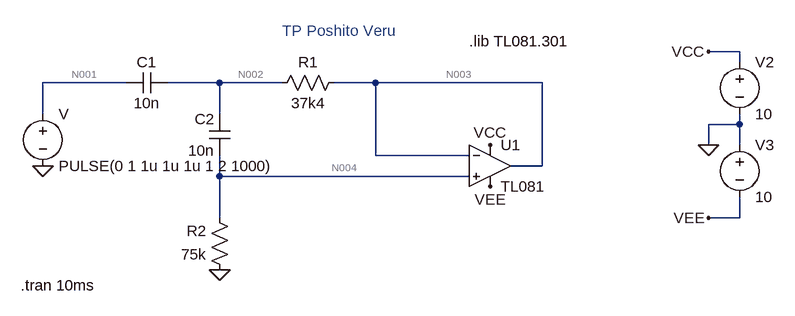
[diagram p0: schematic CIRCUITO_TP_respuesta_escalon.asc]
CIRCUITO_TP_respuesta_escalon.asc, the LTspice schematic file:
Version 4
SHEET 1 1032 680
WIRE 944 -64 896 -64
WIRE 944 -48 944 -64
WIRE 0 -16 -128 -16
WIRE 144 -16 64 -16
WIRE 240 -16 144 -16
WIRE 384 -16 320 -16
WIRE 640 -16 384 -16
WIRE -128 32 -128 -16
WIRE 144 32 144 -16
WIRE 944 48 944 32
WIRE 944 48 896 48
WIRE 896 80 896 48
WIRE 944 80 944 48
WIRE 384 96 384 -16
WIRE 528 96 384 96
WIRE 640 112 640 -16
WIRE 640 112 592 112
WIRE 144 128 144 96
WIRE 528 128 144 128
WIRE 144 192 144 128
WIRE 944 192 944 160
WIRE 944 192 896 192
FLAG -128 112 0
FLAG 144 272 0
FLAG 560 144 VEE
FLAG 560 80 VCC
FLAG 896 80 0
FLAG 896 192 VEE
FLAG 896 -64 VCC
SYMBOL cap 64 -32 R90
WINDOW 0 0 32 VBottom 2
WINDOW 3 32 32 VTop 2
SYMATTR InstName C1
SYMATTR Value 10n
SYMBOL cap 160 96 R180
WINDOW 0 24 56 Left 2
WINDOW 3 24 8 Left 2
SYMATTR InstName C2
SYMATTR Value 10n
SYMBOL res 336 -32 R90
WINDOW 0 0 56 VBottom 2
WINDOW 3 32 56 VTop 2
SYMATTR InstName R1
SYMATTR Value 37k4
SYMBOL res 160 288 R180
WINDOW 0 36 76 Left 2
WINDOW 3 36 40 Left 2
SYMATTR InstName R2
SYMATTR Value 75k
SYMBOL Opamps\\opamp2 560 48 R0
SYMATTR InstName U1
SYMATTR Value TL081
SYMBOL voltage 944 -64 R0
WINDOW 123 0 0 Left 0
WINDOW 39 0 0 Left 0
SYMATTR InstName V2
SYMATTR Value 10
SYMBOL voltage 944 64 R0
WINDOW 123 0 0 Left 0
WINDOW 39 0 0 Left 0
SYMATTR InstName V3
SYMATTR Value 10
SYMBOL voltage -128 16 R0
WINDOW 123 0 0 Left 2
WINDOW 39 0 0 Left 2
SYMATTR InstName V
SYMATTR Value PULSE(0 1 1u 1u 1u 1 2 1000)
TEXT 528 -80 Left 2 !.lib TL081.301
TEXT 240 -96 Left 2 ;TP Poshito Veru
TEXT -162 296 Left 2 !.tran 10ms

The netlist it stands for:
* CIRCUITO_TP_respuesta_escalon.asc
C1 N002 N001 10n
C2 N004 N002 10n
R1 N003 N002 37k4
R2 0 N004 75k
XU1 N004 N003 VCC VEE N003 TL081  ; pins In+ In- V+ V- OUT
V2 VCC 0 10
V3 0 VEE 10
V N001 0 PULSE(0 1 1u 1u 1u 1 2 1000)
.lib TL081.301
* TP Poshito Veru
.tran 10ms
.backanno
.end

* Results of the author's LTspice run, read from the files saved beside the schematic
* Operating Point, zero values left out:
*   V(n002) = 7.967 µV
*   V(n004) = -3.004 µV
*   V(n003) = 7.967 µV
*   V(vee) = -10 V
*   V(vcc) = 10 V
*   I(R2) = 40.05 pA
*   I(V3) = -9.528 mA
*   I(V2) = -9.528 mA
*   Ix(u1:1) = 40.05 pA
*   Ix(u1:2) = 40.05 pA
*   Ix(u1:3) = 9.528 mA
*   Ix(u1:4) = -9.528 mA
*   Ix(u1:5) = -40.05 pA
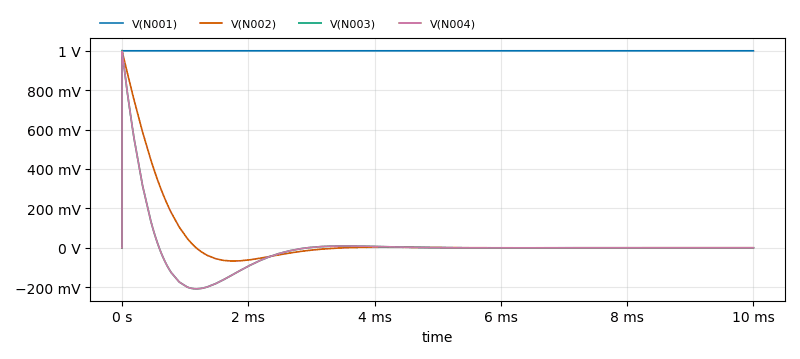
[diagram p1: Transient Analysis of CIRCUITO_TP_respuesta_escalon.asc, plotted from the saved traces]
* Transient Analysis, 1 run:
*   V(N001): min 0 V, max 1 V, average 999.9 mV, rms 999.9 mV, last 1 V
*   V(N002): min -67.37 mV, max 999.2 mV, average 37.51 mV, rms 168.2 mV, last 9.099 µV
*   V(N003): min -208.2 mV, max 1.002 V, average 193 µV, rms 138.4 mV, last 7.935 µV
*   V(N004): min -208.2 mV, max 998.5 mV, average 182 µV, rms 138.4 mV, last -3.036 µV